# EAGLE schematic 770LCM (EAGLE 7.5.0)
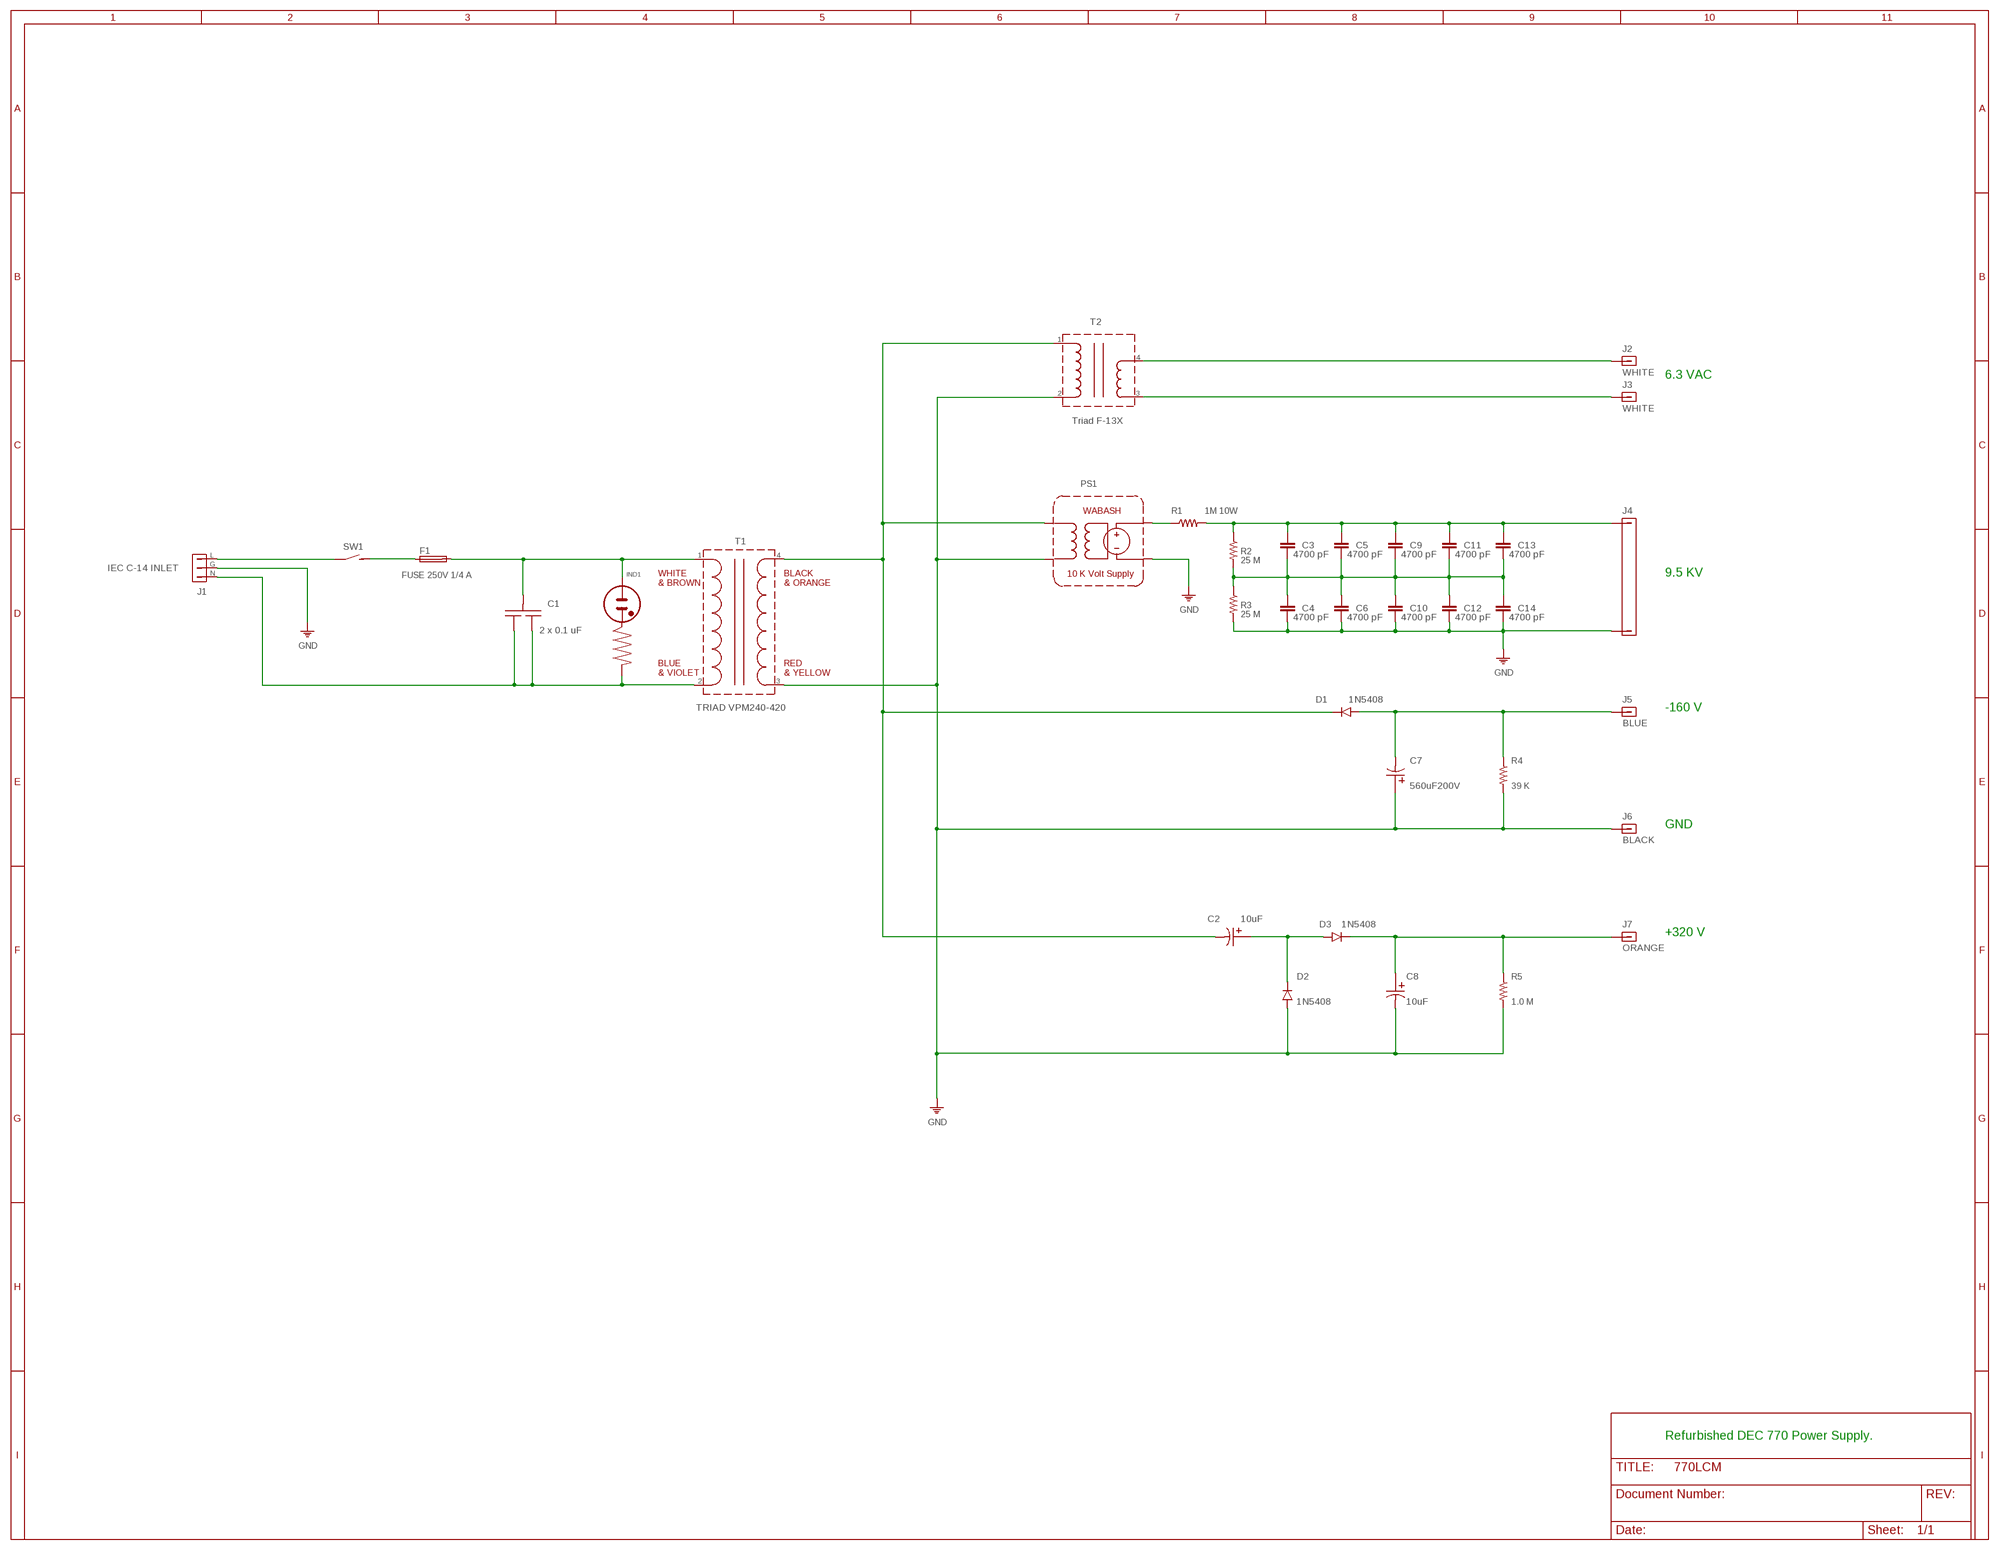
[diagram p0: schematic, sheet 1]

## Parts
C1  2 x 0.1 uF  SPLIT-CAP  [THREE-PIN]
C2  10uF  CAP400V10UF  [AXIAL10UF400V]
C3  4700 pF  C-0.1  [C2.5]
C4  4700 pF  C-0.1  [C2.5]
C5  4700 pF  C-0.1  [C2.5]
C6  4700 pF  C-0.1  [C2.5]
C7  560uF200V  WIREDCAP  [WIREDCAP]
C8  10uF  CAP400V10UF  [AXIAL10UF400V]
C9  4700 pF  C-0.1  [C2.5]
C10  4700 pF  C-0.1  [C2.5]
C11  4700 pF  C-0.1  [C2.5]
C12  4700 pF  C-0.1  [C2.5]
C13  4700 pF  C-0.1  [C2.5]
C14  4700 pF  C-0.1  [C2.5]
D1  1N5408  [DO-201AD]
D2  1N5408  [DO-201AD]
D3  1N5408  [DO-201AD]
F1  FUSE 250V 1/4 A  FUSEFAS  [FUSE_HOLDER_SCHURTER-FAS]
IND1  NEON_INDICATOR  [TWO-PIN]
J1  IEC C-14 INLET  IEC-C14  [IEC_CONNECTOR]
J2  WHITE  BANANA_JACK  [AWG18]
J3  WHITE  BANANA_JACK  [AWG18]
J4  HV_CONN  [TWO-PIN]
J5  BLUE  BANANA_JACK  [AWG18]
J6  BLACK  BANANA_JACK  [AWG18]
J7  ORANGE  BANANA_JACK  [AWG18]
PS1  WABASH-HV  [TRANSFORMER]
R1  1M 10W  RES-H  [0207/10]
R2  25 M  RES-V  [0207/10]
R3  25 M  RES-V  [0207/10]
R4  39 K  RES-V  [0207/10]
R5  1.0 M  RES-V  [0207/10]
SW1  SWITCH  [SWITCH]
T1  TRIAD VPM240-420  TRANSFORMER  [TRANSFORMER]
T2  Triad F-13X  SMALLTRANSFORMER  [TRANSFORMER]

## Nets
GND: C4.2 C6.2 C7.P$1 C8.P$2 C10.2 C12.2 C14.2 D2.A J1.G J4.P$2(L1) J6.P$1(L1) PS1.2(AC2) PS1.3(GND) R3.2 R4.2 R5.2 T1.3 T2.2
N$1: J1.L(N) SW1.P$1(P)
N$2: C1.P$1 C1.P$2 IND1.P$2(A1) J1.N(L) T1.2
N$3: C1.P$3 F1.B IND1.P$1(A) T1.1
N$4: F1.A SW1.P$2(S)
N$5: C2.P$2 D1.C PS1.1(AC1) T1.4 T2.1
N$6: C7.P$2 D1.A J5.P$1(L1) R4.1
N$7: J2.P$1(L1) T2.4
N$8: J3.P$1(L1) T2.3
N$9: C3.1 C5.1 C9.1 C11.1 C13.1 J4.P$1(L) R1.2 R2.1
N$10: C3.2 C4.1 C5.2 C6.1 C9.2 C10.1 C11.2 C12.1 C13.2 C14.1 R2.2 R3.1
N$14: C2.P$1 D2.C D3.A
N$15: C8.P$1 D3.C J7.P$1(L1) R5.1
N$17: PS1.4(HV) R1.1

## Notes on the sheet
- 6.3 VAC
- 9.5 KV
- -160 V
- GND
- +320 V
- Refurbished DEC 770 Power Supply.

## Library data of the parts
C1 = keiths:SPLIT-CAP: Two capacitors with a common plate.
C2 C8 = keiths:CAP400V10UF: ALUMINUM ELECTROLYTIC CAPACITOR 400volts 10uF 13x26 20%
C3-C6 C9-C14 = keiths:C-0.1: Through hole radial capacitor. 0.1 inch lead to lead.
C7 = keiths:WIREDCAP: A soldier pad.
D1-D3 = keiths:1N5408: 1N5408 Rectifier Diode 3A 1000V
F1 = fuse:FUSE: Fuse; MPN: 0031.3501; OC_FARNELL: 1214778; OC_NEWARK: 98K4273
IND1 = keiths:NEON_INDICATOR: NEON POWER INDICATOR
J1 = keiths:IEC-C14: C14 AC Power Socket Inlet
J2 J3 J5-J7 = keiths:BANANA_JACK: JACK
J4 = keiths:HV_CONN: High Voltage Connector
PS1 = keiths:WABASH-HV
R1 = keiths:RES-H: 1/4 watt through hole size
R2-R5 = keiths:RES-V: 1/4 watt through hole size
SW1 = keiths:SWITCH: Simple switch
T1 = keiths:TRANSFORMER: Old School Transformer
T2 = keiths:SMALLTRANSFORMER: SMALL TRANSFORMER